# Altium schematic sheet PLC.SchDoc
size A
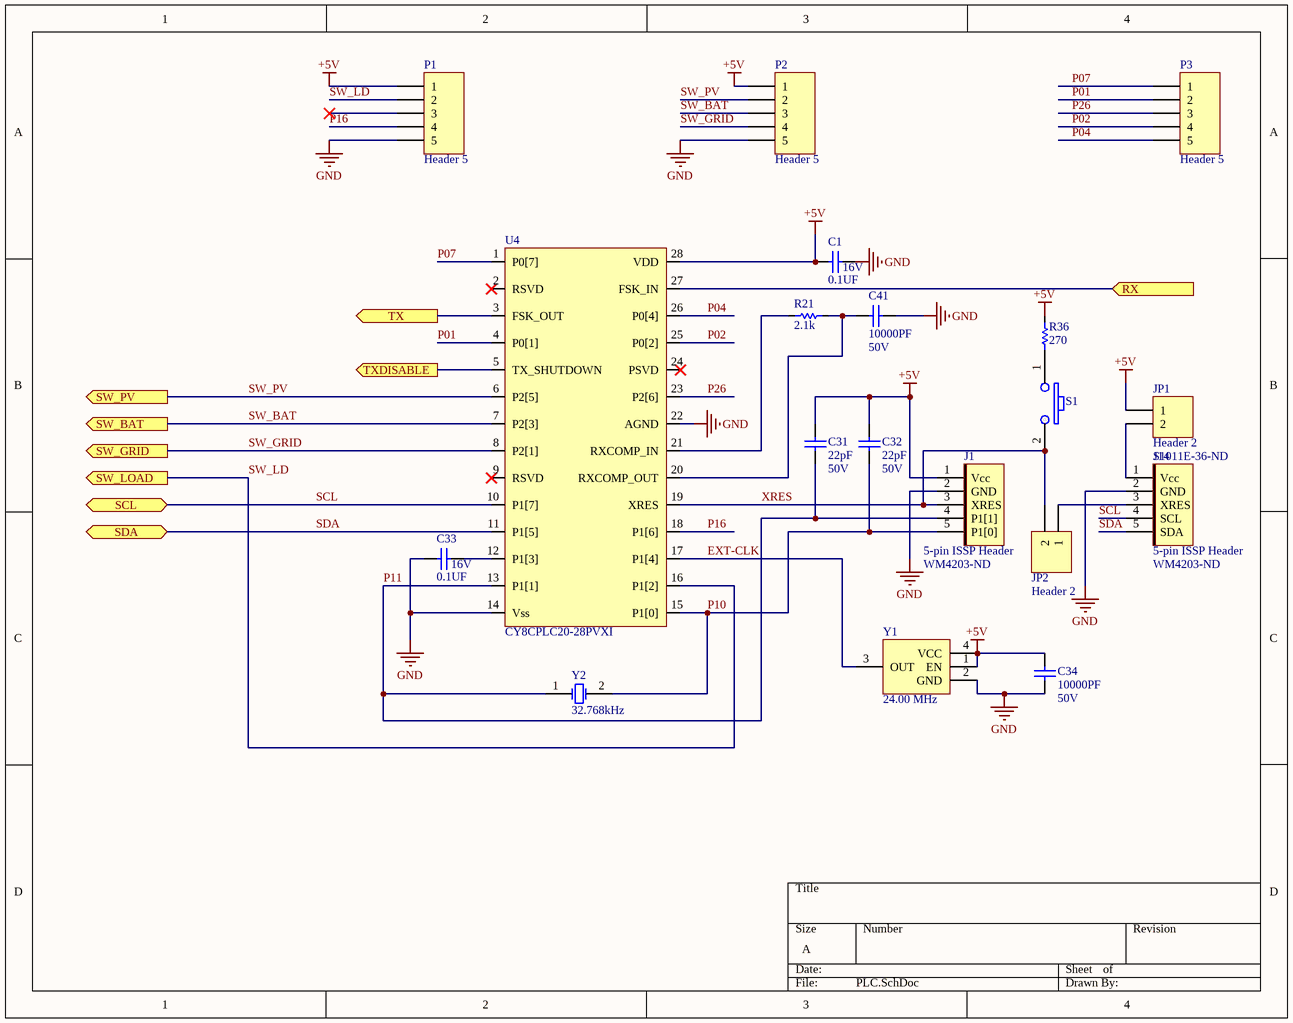
[diagram p0: PLC.SchDoc]

## Parts
C1  Capacitance: 0.1UF  Voltage - Rated: 16V  [CAPC1608X08N]  (hidden comment: GRM188R71C104KA01D)
C31  Capacitance: 22pF  Voltage - Rated: 50V  [CAPC1608X08N]  (hidden comment: GRM1885C1H220JA01D)
C32  Capacitance: 22pF  Voltage - Rated: 50V  [CAPC1608X08N]  (hidden comment: GRM1885C1H220JA01D)
C33  Capacitance: 0.1UF  Voltage - Rated: 16V  [CAPC1608X08N]  (hidden comment: GRM188R71C104KA01D)
C34  Capacitance: 10000PF  Voltage - Rated: 50V  [CAPC1608X08N]  (hidden comment: GRM188R71H103KA01D)
C41  Capacitance: 10000PF  Voltage - Rated: 50V  [CAPC1608X08N]  (hidden comment: GRM188R71H103KA01D)
J1  5-pin ISSP Header  Supplier Part Number 1: WM4203-ND  [ISPCON]
J14  5-pin ISSP Header  Supplier Part Number 1: WM4203-ND  [ISPCON]
JP1  Header 2  Supplier Part Number 1: S1011E-36-ND  [HDR1X2]
JP2  Header 2  [HDR1X2]
P1  Header 5  [HDR1X5]
P2  Header 5  [HDR1X5]
P3  Header 5  [HDR1X5]
R21  Resistance: 2.1k  [RESC1608X06N]  (hidden comment: RC0603FR-072K1L)
R36  Resistance: 270  [RESC1608X06N]  (hidden comment: RC0603JR-07270RL)
S1  B3F-1022  [STDSW]  (value not drawn)
U4  CY8CPLC20-28PVXI  [SOP65P780X200-28N]
Y1  value 24.00 MHz  [CSX-750F]  (hidden comment: CSX-750FCC24000000T)
Y2  32.768kHz  [XTAL32K]

## Ports
RX (in), SCL (bidir), SDA (bidir), SW_BAT (out), SW_GRID (out), SW_LOAD (out), SW_PV (out), TX (out), TXDISABLE (out)

## Nets
+5V: C1.1 C31.2 C32.2 C34.2 J1.1(Vcc) JP1.1 P1.1 P2.1 R36.2 U4.28(VDD) Y1.1(EN) Y1.4(VCC)
GND: C1.2 C33.1 C34.1 C41.1 J1.2(GND) J14.2(GND) P1.5 P2.5 U4.14(Vss) U4.22(AGND) Y1.2(GND)
EXT-CLK: U4.17(P1[4]) Y1.3(OUT)
P01: P3.2 U4.4(P0[1])
P02: P3.4 U4.25(P0[2])
P04: P3.5 U4.26(P0[4])
P07: P3.1 U4.1(P0[7])
P10: C32.1 J1.5(P1[0]) U4.15(P1[0]) Y2.2(OSC2)
P11: C31.1 J1.4(P1[1]) U4.13(P1[1]) Y2.1(OSC1)
P16: P1.4 U4.18(P1[6])
P26: P3.3 U4.23(P2[6])
RX: U4.27(FSK_IN) ; port RX
SCL: J14.4(SCL) U4.10(P1[7]) ; port SCL
SDA: J14.5(SDA) U4.11(P1[5]) ; port SDA
SW_BAT: P2.3 U4.7(P2[3]) ; port SW_BAT
SW_GRID: P2.4 U4.8(P2[1]) ; port SW_GRID
SW_LD: P1.2 U4.16(P1[2]) ; port SW_LOAD
SW_PV: P2.2 U4.6(P2[5]) ; port SW_PV
TX: U4.3(FSK_OUT) ; port TX
TXDISABLE: U4.5(TX_SHUTDOWN) ; port TXDISABLE
XRES: J1.3(XRES) JP2.2 S1.2(NO) U4.19(XRES)
NetC33_2: C33.2 U4.12(P1[3])
NetC41_2: C41.2 R21.2 U4.20(RXCOMP_OUT)
NetJ14_1: J14.1(Vcc) JP1.2
NetJ14_3: J14.3(XRES) JP2.1
NetR21_1: R21.1 U4.21(RXCOMP_IN)
NetR36_1: R36.1 S1.1(C)

Not connected (* = marked no-connect by the designer): P1 3*; U4 2(RSVD)* 9(RSVD)* 24(PSVD)*

## Library data of the parts
C1 C33 = GRM188R71C104KA01D: CAP CER 0.1UF 16V X7R 0603; Manufacturer: Murata Electronics North America; Manufacturer Part Number: GRM188R71C104KA01D; Supplier 1: Digi-Key; Supplier Part Number 1: 490-1532-1-ND
C31 C32 = GRM1885C1H220JA01D: CAP CER 22PF 50V C0G/NP0 0603; Manufacturer: Murata Electronics North America; Manufacturer Part Number: GRM1885C1H220JA01D; Supplier 1: Digi-Key; Supplier Part Number 1: 490-1411-1-ND
C34 C41 = GRM188R71H103KA01D: CAP CER 10000PF 50V X7R 0603; Manufacturer: Murata Electronics North America; Manufacturer Part Number: GRM188R71H103KA01D; Supplier 1: Digi-Key; Supplier Part Number 1: 490-1512-1-ND
J1 = ISSP_CON: CONN HEADER 5POS .100 VERT TIN; Manufacturer: Molex; Manufacturer Part Number: 22-23-2051; Supplier 1: Digi-Key
J14 = I2C_Connector: CONN HEADER 5POS .100 VERT TIN; Manufacturer: Molex; Manufacturer Part Number: 22-23-2051; Supplier 1: Digi-Key
JP1 JP2 = Header 2: Header, 2-Pin; Manufacturer: Sullins Connector Solutions; Manufacturer Part Number: PBC36SAAN; Supplier 1: Digi-Key
  JP2: Supplier Part Number 1: S1011E-36-ND
P1-P3 = Header 5: Header, 5-Pin; Manufacturer Part Number: PBC36SAAN; Manufacturer: Sullins Connector Solutions; Supplier 1: Digi-Key; Supplier Part Number 1: S1011E-36-ND
R21 = RC0603FR-072K1L: RES SMD 2.1K OHM 1% 1/10W 0603; Manufacturer: Yageo; Manufacturer Part Number: RC0603FR-072K1L; Supplier 1: Digi-Key; Supplier Part Number 1: 311-2.10KHRCT-ND
R36 = RC0603JR-07270RL: RES SMD 270 OHM 5% 1/10W 0603; Manufacturer: Yageo; Manufacturer Part Number: RC0603JR-07270RL; Supplier 1: Digi-Key; Supplier Part Number 1: 311-270GRCT-ND
S1 = SPST: Swtich, SPST; Manufacturer: Omron; Manufacturer Part Number: B3F-1022; Supplier 1: Digi-Key; Supplier Part Number 1: SW403-ND
U4 = CY8CPLC20-28PVXI: IC PLC PSOC CMOS 28SSOP; Manufacturer: Cypress Semiconductor Corp; Manufacturer Part Number: CY8CPLC20-28PVXI; Supplier 1: Digi-Key; Supplier Part Number 1: CY8CPLC20-28PVXI-ND
Y1 = CSX-750FCC24000000T: OSC XO 24.000MHZ CMOS TTL SMD; Manufacturer: Citizen Finedevice Co Ltd; Manufacturer Part Number: CSX-750FCC24000000T; Supplier 1: Digi-Key; Supplier Part Number 1: 300-7214-1-ND
Y2 = XTAL: Crystal 32.768kHz 12.5pF; Manufacturer: ECS Inc.; Manufacturer Part Number: ECS-3X8X; Value: 32.768kHz; Supplier 1: Digi-Key; Supplier Part Number 1: X1123-ND